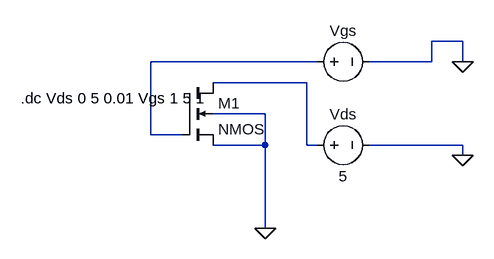
[diagram p0: schematic nmosrig.asc]
nmosrig.asc, the LTspice schematic file:
Version 4.1
SHEET 1 880 680
WIRE 656 176 608 176
WIRE 432 208 176 208
WIRE 608 208 608 176
WIRE 608 208 512 208
WIRE 656 208 656 176
WIRE 416 240 272 240
WIRE 352 288 272 288
WIRE 176 320 176 208
WIRE 224 320 176 320
WIRE 352 336 352 288
WIRE 352 336 272 336
WIRE 416 336 416 240
WIRE 432 336 416 336
WIRE 656 336 512 336
WIRE 656 352 656 336
WIRE 352 464 352 336
FLAG 352 464 0
FLAG 656 352 0
FLAG 656 208 0
SYMBOL nmos4 224 240 R0
SYMATTR InstName M1
SYMBOL voltage 416 208 R270
WINDOW 0 32 56 VTop 2
WINDOW 3 -32 56 VBottom 2
SYMATTR InstName Vgs
SYMATTR Value ""
SYMBOL voltage 416 336 R270
WINDOW 0 32 56 VTop 2
WINDOW 3 -32 56 VBottom 2
SYMATTR InstName Vds
SYMATTR Value 5
TEXT -24 264 Left 2 !.dc Vds 0 5 0.01 Vgs 1 5 1

The netlist it stands for:
* nmosrig.asc
M1 N002 N001 0 0 NMOS
Vgs N001 0
Vds N002 0 5
.model NMOS NMOS
.model PMOS PMOS
.lib standard.mos
.dc Vds 0 5 0.01 Vgs 1 5 1
.backanno
.end